# Altium schematic sheet [10]-Motor Driver-2.SchDoc: Mixed Signal Board
size A4; Author: AVIRAL MISHRA; DocumentNumber: 10; SheetNumber: 10; SheetTotal: 11; PROJECT CODE: A_V1.0
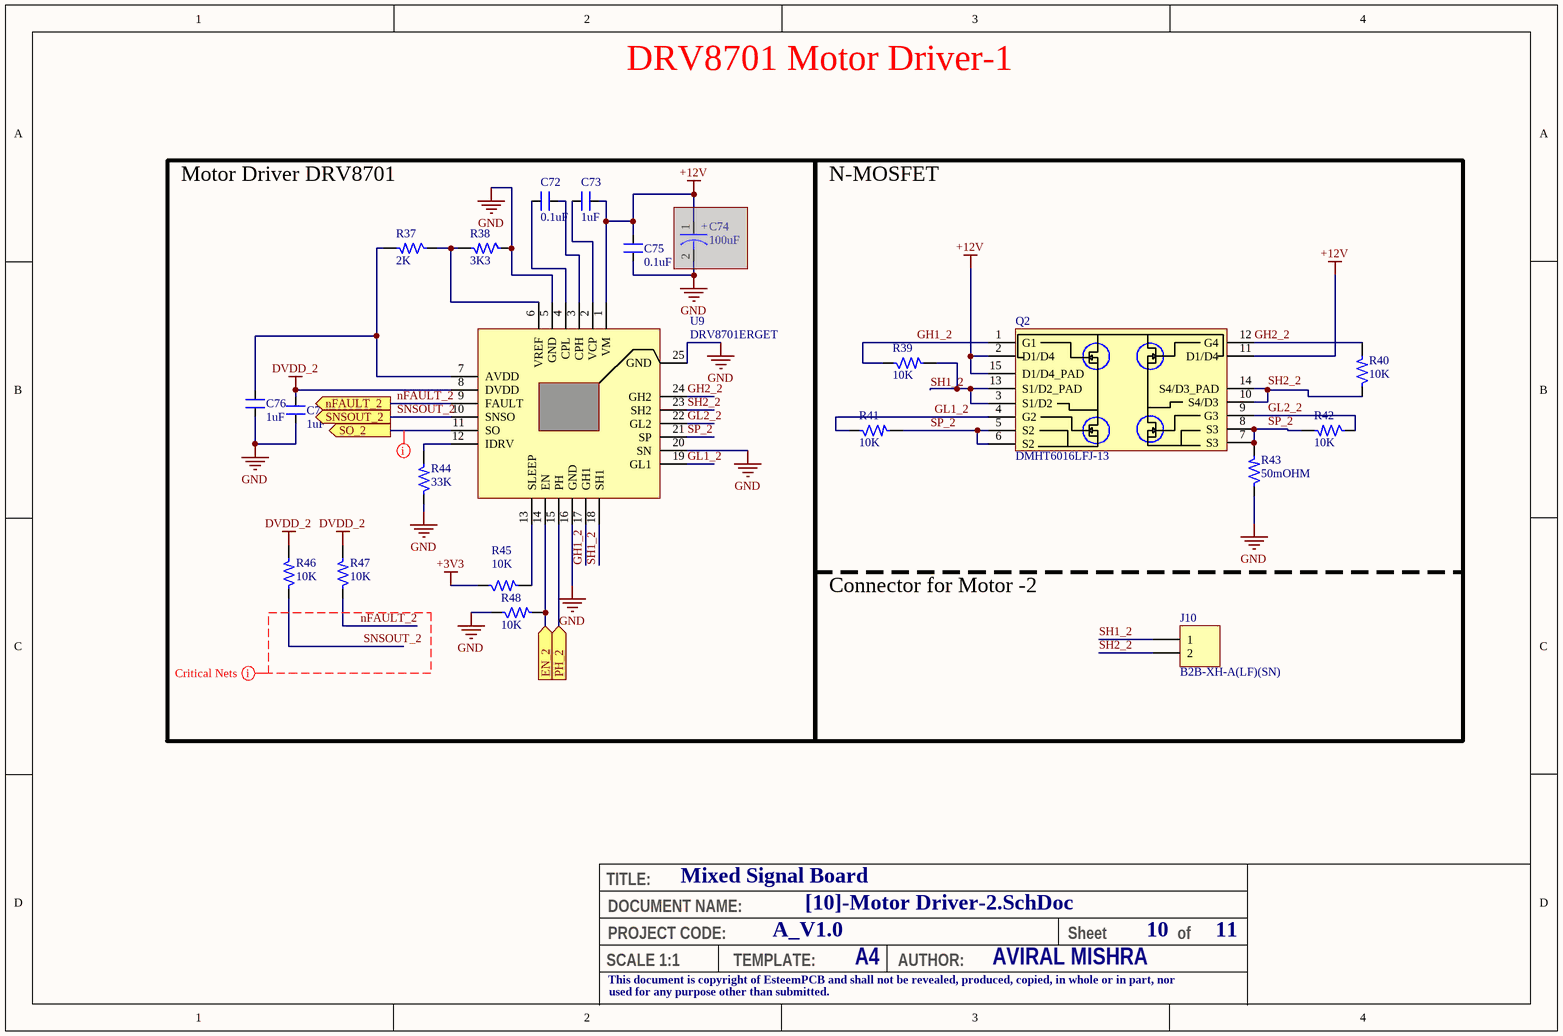
[diagram p0: [10]-Motor Driver-2.SchDoc]

## Parts
C72  0.1uF  [CAP_0805]
C73  1uF  [CAP_0805]
C74  100uF  [ACAP_P236_D305_H303_RAD]  (masked out: inside a compile mask, not in the netlist)
C75  0.1uF  [CAP_0805]
C76  1uF  [CAP_0805]
C77  1uF  [CAP_0805]
J10  B2B-XH-A(LF)(SN)  [CON2_100_B2B-XH-A_TH_ST]
Q2  DMHT6016LFJ-13  [DFN5045-12_33_212_27X15_SMD_1]
R37  2K  [RES_0603]
R38  3K3  [RES_0603]
R39  10K  [RES_0603]
R40  10K  [RES_0603]
R41  10K  [RES_0603]
R42  10K  [RES_0603]
R43  50mOHM  [RES_2512]
R44  33K  [RES_0805]
R45  10K  [RES_0603]
R46  10K  [RES_0603]
R47  10K  [RES_0603]
R48  10K  [RES_0603]
U9  DRV8701ERGET  [VFQFN24_19.6_196_12X32_SMD_1]

## Blocks framed on the sheet
Motor Driver DRV8701: C72-C77 R37 R38 R44-R48 U9

## Ports
EN_2 (in), nFAULT_2 (out), PH_2 (in), SNSOUT_2 (out), SO_2 (out)

## Nets
+3V3: R45.1
+12V: C73.2 C75.2 Q2.2(D1/D4) Q2.11(D1/D4) Q2.15(D1/D4_PAD) U9.1(VM)
DVDD_2: C77.2 R46.2 R47.2 U9.8(DVDD)
GND: C75.1 C76.1 C77.1 R38.1 R43.1 R44.1 R48.1 U9.5(GND) U9.16(GND) U9.20(SN) U9.25(GND)
EN_2: R48.2 U9.14(EN) ; port EN_2
GH1_2: Q2.1(G1) R39.1 U9.17(GH1)
GH2_2: Q2.12(G4) R40.2 U9.24(GH2)
GL1_2: Q2.4(G2) R41.1 U9.19(GL1)
GL2_2: Q2.9(G3) R42.1 U9.22(GL2)
nFAULT_2: R47.1 U9.9(FAULT) ; port nFAULT_2
PH_2: U9.15(PH) ; port PH_2
SH1_2: J10.1 Q2.3(S1/D2) Q2.13(S1/D2_PAD) R39.2 U9.18(SH1)
SH2_2: J10.2 Q2.10(S4/D3) Q2.14(S4/D3_PAD) R40.1 U9.23(SH2)
SNSOUT_2: R46.1 U9.10(SNSO) ; port SNSOUT_2
SO_2: U9.11(SO) ; port SO_2
SP_2: Q2.5(S2) Q2.6(S2) Q2.7(S3) Q2.8(S3) R41.2 R42.2 R43.2 U9.21(SP)
NetC72_1: C72.1 U9.3(CPH)
NetC72_2: C72.2 U9.4(CPL)
NetC73_1: C73.1 U9.2(VCP)
NetC76_2: C76.2 R37.2 U9.7(AVDD)
NetR37_1: R37.1 R38.2 U9.6(VREF)
NetR44_2: R44.2 U9.12(IDRV)
NetR45_2: R45.2 U9.13(SLEEP)

## Layout directives
net class Critical Nets: nFAULT_2, SNSOUT_2, SO_2

## Notes on the sheet
- DRV8701 Motor Driver-1
- N-MOSFET
- Connector for Motor -2
- TITLE:
- DOCUMENT NAME:
- SCALE 1:1
- This document is copyright of EsteemPCB and shall not be revealed, produced, copied, in whole or in part, nor
- PROJECT CODE:
- TEMPLATE:
- A4
- AUTHOR:
- Sheet
- of
- used for any purpose other than submitted.
- (in symbol CAP-P_100uF-25V-20%-RAD) +

## Library data of the parts
C72 C75 = CAP_0.1uF-50V-10%-0805: 0.1µF ±10% 50V Ceramic Capacitor X7R 0805 (2012 Metric) /; Manufacturer: Samsung; Manufacturer Part Number: CL21B104KBCNNNC; Alternate Part Number-1: NA; Case/Package: 0805; Supplier-1: SIRICOM; Supplier Part Number-1: 0805B104K500CT
C73 C76 C77 = CAP_1uF-50V-5%-0805: 1µF ±5% 50V Ceramic Capacitor X7R 0805 (2012 Metric) /; Manufacturer: Samsung; Manufacturer Part Number: CC0805JKX7R9BB105; Alternate Part Number-1: 0805F105M500NT; Case/Package: 0805; Supplier-1: SIRICOM; Supplier Part Number-1: CL21B105KBFNNNE
C74 = CAP-P_100uF-25V-20%-RAD: 100µF 25V Aluminum Electrolytic Capacitors Radial, Can - SMD 1000 Hrs @ 105°C /; Manufacturer: Nichicon; Manufacturer Part Number: UWT1E101MCL1GS; Alternate Part Number-1: NA; Case/Package: Radial-SMD; Supplier-1: SP ROAD; Supplier Part Number-1: UWT1E101MCL1GS
J10 = CON-PLG_2X1-100-ST-TH: 2 Pins, 1 Row 2.54mm Pitch, Straight Connector, male; Manufacturer: JST; Mating Part Number: XHP-2; Crimp Part Number: ASXHSXH22K51; Alternate Part Number-1: NA; Manufacturer Part Number: B2B-XH-A(LF)(SN); Case/Package: TH-CON; Supplier-1: SP ROAD; Supplier Part Number-1: B2B-XH-A(LF)(SN)
Q2 = MOSFET-N_60V-14.8A-V-DFN5045-12: Mosfet Array 4 N-Channel 14.8A (Ta) Surface Mount V-DFN5045-12; Manufacturer: ON Semiconductor; Alternate Part Number-1: DMHT3006LFJ-13; Manufacturer Part Number: DMHT6016LFJ-13; Case/Package: DFN5045-12; Supplier-1: LCSC; Supplier Part Number-1: C460986
R37 = RES_2K-0.125W-1%-0603: 2 kOhms ±1% 0.125W, 1/8W Chip Resistor 0603 (1608 Metric) Anti-Sulfur, Moisture Resistant Thin Film /; Manufacturer: Stackpole Electronics; Manufacturer Part Number: RNCP0603FTD2K00; Alternate Part Number-1: NA; Case/Package: 0603; Supplier-1: SIRICOM; Supplier Part Number-1: WR06X2001FTL
R38 = RES_3.3K-0.1W-1%-0603: 3.3 kOhms ±1% 0.1W, 1/10W Chip Resistor 0603 (1608 Metric) Automotive AEC-Q200 Thick Film /; Manufacturer: Wilson; Manufacturer Part Number: WR06X3301FTL; Alternate Part Number-1: 0603WAF3301T5E; Case/Package: 0603; Supplier-1: SIRICOM; Supplier Part Number-1: WR06X3301FTL
R39-R42 R45-R48 = RES_10K-0.1W-1%-0603: 10 kOhms ±1% 0.1W, 1/10W Chip Resistor 0603 (1608 Metric) Automotive AEC-Q200 Thick Film /; Manufacturer: Walsin; Manufacturer Part Number: WR06X1002FTL; Alternate Part Number-1: 0603WAJ0103T5E; Case/Package: 0603; Supplier-1: SIRICOM; Supplier Part Number-1: WR06X1002FTL
R43 = RES_50mOhm-2W-1%-2512: 50 mOhms ±1% 2W Chip Resistor 2512 (6432 Metric) Automotive AEC-Q200, Current Sense, Moisture Resistant Metal Element /; Manufacturer: Yageo; Manufacturer Part Number: PA2512FKF7W0R05E; Alternate Part Number-1: PMR100HZPFU5L00; Case/Package: 2512; Supplier-1: SIRICOM; Supplier Part Number-1: LR2512-22R060F1
R44 = RES_33K-0.125W-1%-0805: Thick Film Resistors - SMD 33KOhms 1/8W 150V33 kOhms ±1% 0.125W, 1/8W Chip Resistor 0805 (2012 Metric) Thick Film /; Manufacturer: Vishay BCcomponents; Manufacturer Part Number: CRG0805F33K; Alternate Part Number-1: NA; Case/Package: 0805; Supplier-1: SIRICOM; Supplier Part Number-1: WR08X3302FTL
U9 = IC_DRV8701ERGET: Motor Driver Power MOSFET Parallel 24-VQFN (4x4); Manufacturer: Texas Instruments; Alternate Part Number-1: NA; Manufacturer Part Number: DRV8701ERGET; Case/Package: VFQFN24; Supplier-1: ARROW; Supplier Part Number-1: DRV8701ERGET